# EAGLE board LEDpanelmpsl (EAGLE 6.6.0)
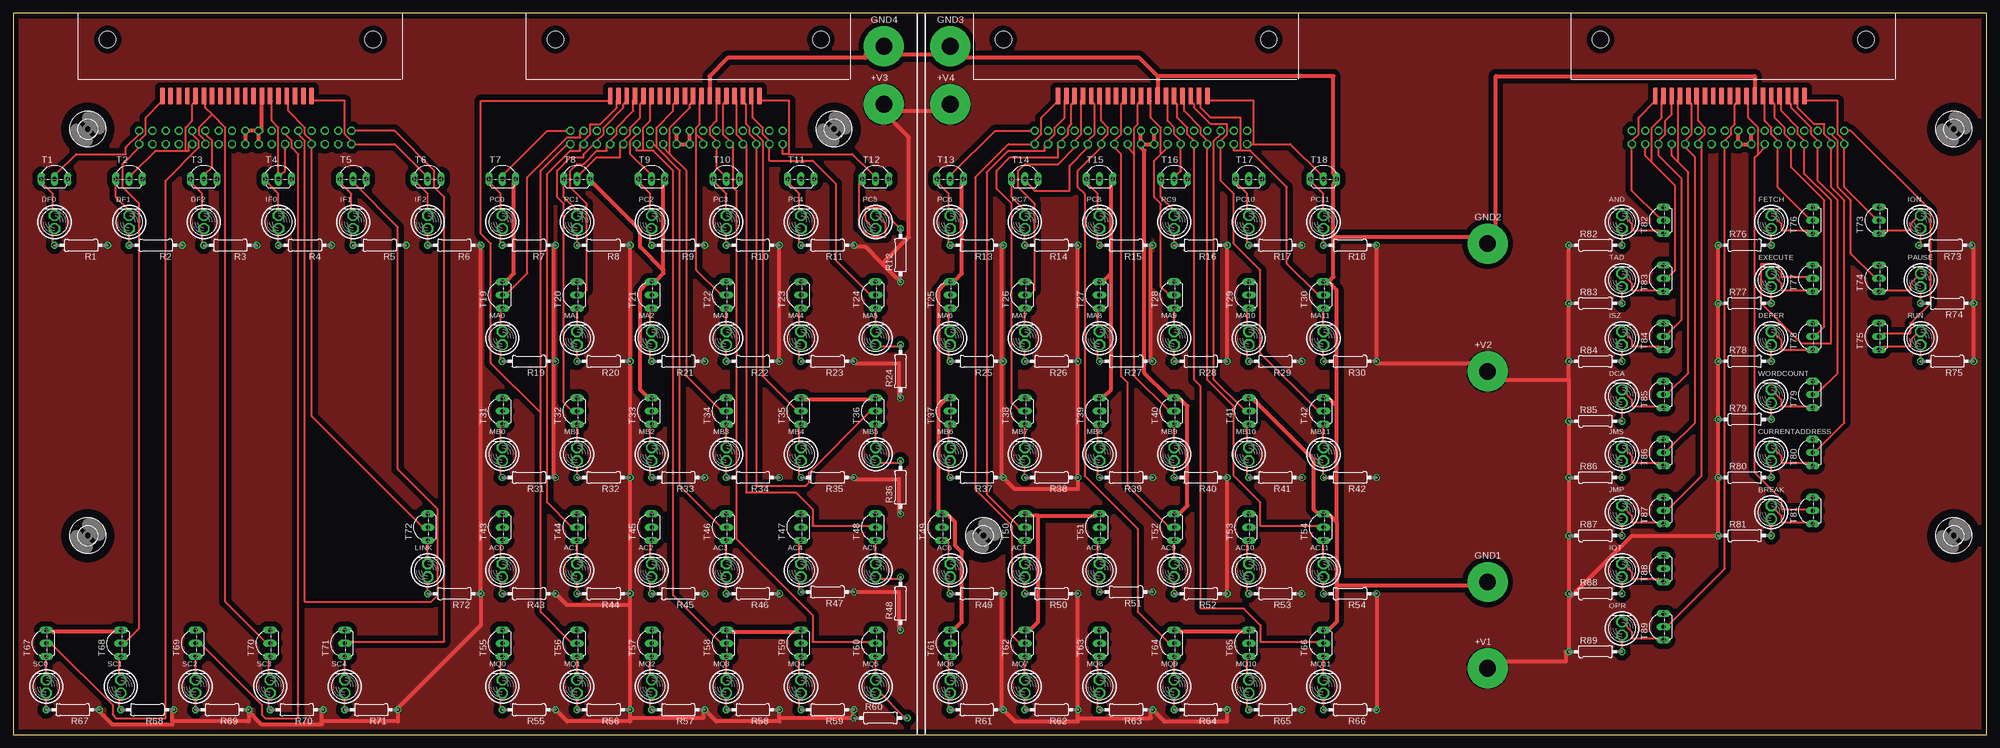
[diagram p2: board, top side]
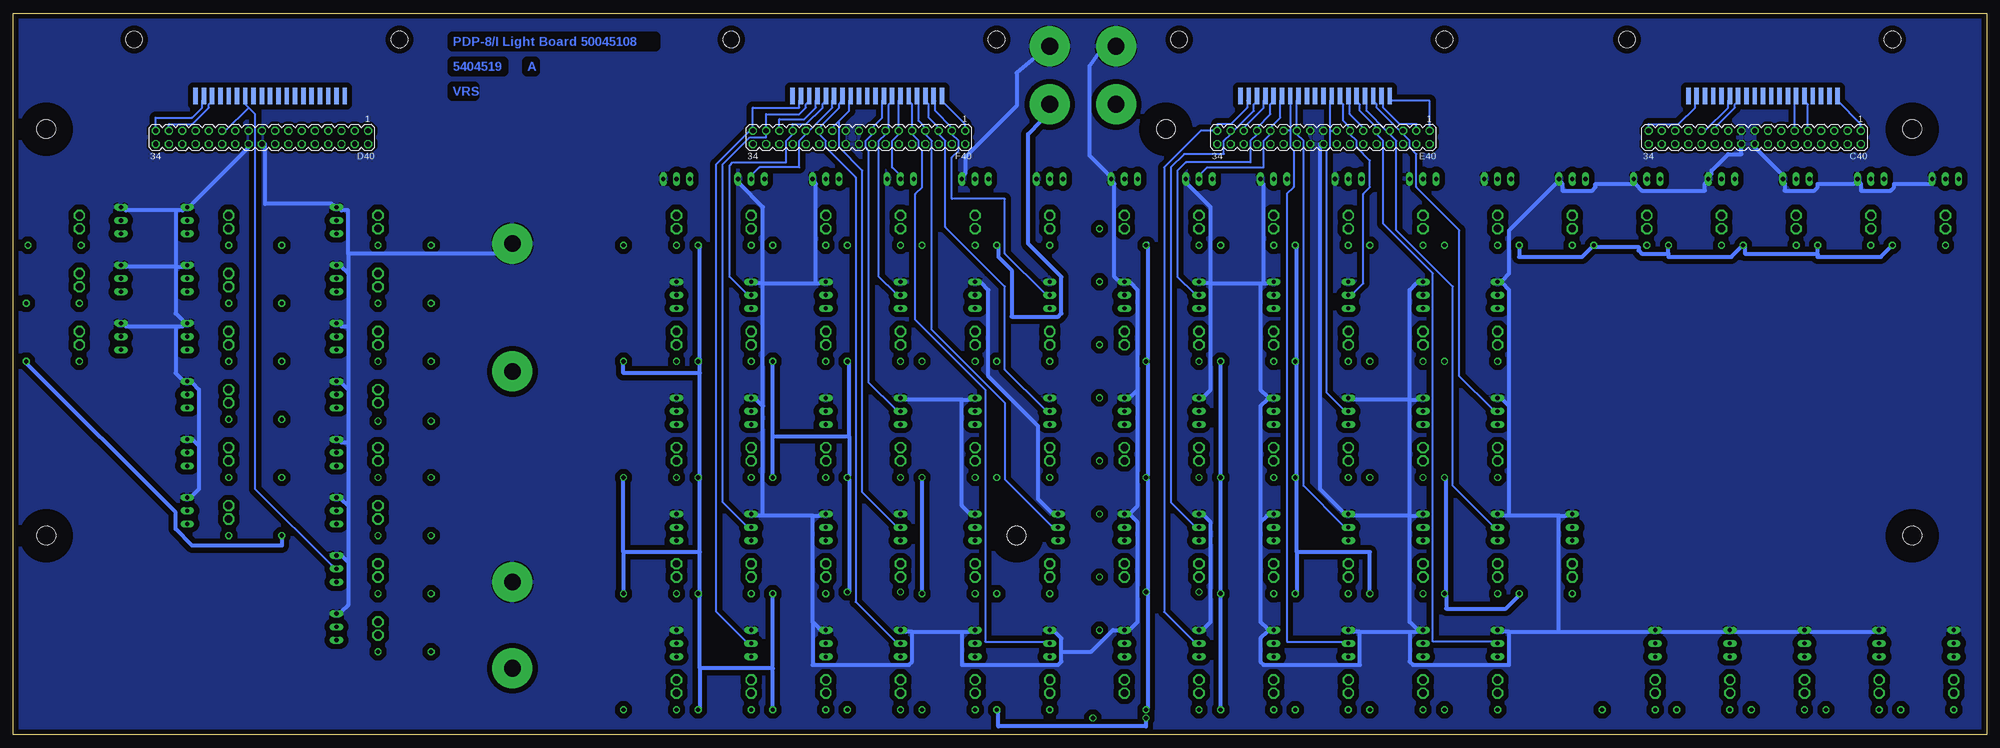
[diagram p3: board, bottom side, seen from below]

Size 377.82 x 138.11 mm. Coordinates in mm from the lower left corner, seen from the top.
Outline: 377.82,0 377.82,138.11 0,138.11 0,0 377.82,0
Copper layers (1*16): Top 0.035mm / dielectric 1.5mm / Bottom 0.035mm
Design rules "15mils": minimum track width 15mil, minimum drill 24mil, track to track 15mil, track to pad 10mil, pad to pad 10mil, via to via 10mil, smd to smd 10mil, copper to edge 25mil, drill to drill 10mil, minimum pad ring 10mil, minimum via ring 8mil, stop-mask expansion 0mil, vias tented up to drill 0mil, thermal gap 10mil
Net classes: 1 supply: width 0.762 mm

## Footprints (pad centres in the part's own frame; a part is rotated, then mirrored left to right if it is on the bottom)
SPADELUG = drill 3.175 pad 7.62: 1 0,0
BULB = drill 1.422 octagon: A 0,0; B 0,2.54
MA17-2 = drill 1.016 octagon: 1 -20.32,-1.27; 2 -20.32,1.27; 3 -17.78,-1.27; 4 -17.78,1.27; 5 -15.24,-1.27; 6 -15.24,1.27; 7 -12.7,-1.27; 8 -12.7,1.27; 9 -10.16,-1.27; 10 -10.16,1.27; 11 -7.62,-1.27; 12 -7.62,1.27; 13 -5.08,-1.27; 14 -5.08,1.27; 15 -2.54,-1.27; 16 -2.54,1.27; 17 0,-1.27; 18 0,1.27; 19 2.54,-1.27; 20 2.54,1.27; 21 5.08,-1.27; 22 5.08,1.27; 23 7.62,-1.27; 24 7.62,1.27; 25 10.16,-1.27; 26 10.16,1.27; 27 12.7,-1.27; 28 12.7,1.27; 29 15.24,-1.27; 30 15.24,1.27; 31 17.78,-1.27; 32 17.78,1.27; 33 20.32,-1.27; 34 20.32,1.27
FLEX19 = smd 3.175 x 0.838: 1 0,14.287; 2 0,12.7; 3 0,11.113; 4 0,9.525; 5 0,7.938; 6 0,6.35; 7 0,4.763; 8 0,3.175; 9 0,1.587; 10 0,0; 11 0,-1.587; 12 0,-3.175; 13 0,-4.763; 14 0,-6.35; 15 0,-7.938; 16 0,-9.525; 17 0,-11.113; 18 0,-12.7; 19 0,-14.287
0207/10 = drill 0.813 octagon: 1 -5.08,0; 2 5.08,0
TO92-CBE = drill 0.813 long: B 0,0; C -2.54,0; E 2.54,0
STRAIN-RELIEF = hole 3.175: 7.62,56.515; 7.62,5.715
3,6 = hole 3.6: 0,0

## Placement (x,y rotation side)
+V1  LUG  [SPADELUG]  282.26,12.7 0 top
+V2  LUG  [SPADELUG]  282.26,69.53 0 top
+V3  LUG  [SPADELUG]  166.69,120.65 0 top
+V4  LUG  [SPADELUG]  179.39,120.65 0 top
AC0  [BULB]  93.66,30.16 0 top
AC1  [BULB]  107.95,30.16 0 top
AC2  [BULB]  122.24,30.16 0 top
AC3  [BULB]  136.53,30.16 0 top
AC4  [BULB]  150.81,30.16 0 top
AC5  [BULB]  165.1,30.16 0 top
AC6  [BULB]  179.39,30.16 0 top
AC7  [BULB]  193.68,30.16 0 top
AC8  [BULB]  207.96,30.16 0 top
AC9  [BULB]  222.25,30.16 0 top
AC10  [BULB]  236.54,30.16 0 top
AC11  [BULB]  250.82,30.16 0 top
AND  [BULB]  307.98,96.84 0 top
BREAK  [BULB]  336.55,41.27 0 top
C40  [MA17-2]  44.45,114.3 180 bottom
C40BOT  FLEX19  [FLEX19]  42.86,122.24 90 top
C40TOP  FLEX19  [FLEX19]  42.86,122.24 270 bottom
CURRENTADDRESS  [BULB]  336.55,52.39 0 top
D40  [MA17-2]  330.2,114.3 180 bottom
D40BOT  FLEX19  [FLEX19]  128.59,122.24 90 top
D40TOP  FLEX19  [FLEX19]  128.59,122.24 270 bottom
DCA  [BULB]  307.98,63.5 0 top
DEFER  [BULB]  336.55,74.61 0 top
DF0  [BULB]  7.94,96.84 0 top
DF1  [BULB]  22.23,96.84 0 top
DF2  [BULB]  36.51,96.84 0 top
E40  [MA17-2]  127,114.3 180 bottom
E40BOT  FLEX19  [FLEX19]  214.31,122.24 90 top
E40TOP  FLEX19  [FLEX19]  214.31,122.24 270 bottom
EXECUTE  [BULB]  336.55,85.72 0 top
F40  [MA17-2]  215.9,114.3 180 bottom
F40BOT  FLEX19  [FLEX19]  328.61,122.24 90 top
F40TOP  FLEX19  [FLEX19]  328.61,122.24 270 bottom
FETCH  [BULB]  336.55,96.84 0 top
GND1  LUG  [SPADELUG]  282.26,29.21 0 top
GND2  LUG  [SPADELUG]  282.26,93.98 0 top
GND3  LUG  [SPADELUG]  179.39,131.76 0 top
GND4  LUG  [SPADELUG]  166.69,131.76 0 top
IF0  [BULB]  50.8,96.84 0 top
IF1  [BULB]  65.09,96.84 0 top
IF2  [BULB]  79.38,96.84 0 top
ION  [BULB]  365.12,96.84 0 top
IOT  [BULB]  307.98,30.16 0 top
ISZ  [BULB]  307.98,74.61 0 top
JMP  [BULB]  307.98,41.27 0 top
JMS  [BULB]  307.98,52.39 0 top
LINK  [BULB]  79.38,30.16 0 top
MA0  [BULB]  93.66,74.61 0 top
MA1  [BULB]  107.95,74.61 0 top
MA2  [BULB]  122.24,74.61 0 top
MA3  [BULB]  136.53,74.61 0 top
MA4  [BULB]  150.81,74.61 0 top
MA5  [BULB]  165.1,74.61 0 top
MA6  [BULB]  179.39,74.61 0 top
MA7  [BULB]  193.68,74.61 0 top
MA8  [BULB]  207.96,74.61 0 top
MA9  [BULB]  222.25,74.61 0 top
MA10  [BULB]  236.54,74.61 0 top
MA11  [BULB]  250.82,74.61 0 top
MB0  [BULB]  93.66,52.39 0 top
MB1  [BULB]  107.95,52.39 0 top
MB2  [BULB]  122.24,52.39 0 top
MB3  [BULB]  136.53,52.39 0 top
MB4  [BULB]  150.81,52.39 0 top
MB5  [BULB]  165.1,52.39 0 top
MB6  [BULB]  179.39,52.39 0 top
MB7  [BULB]  193.68,52.39 0 top
MB8  [BULB]  207.96,52.39 0 top
MB9  [BULB]  222.25,52.39 0 top
MB10  [BULB]  236.54,52.39 0 top
MB11  [BULB]  250.82,52.39 0 top
MQ0  [BULB]  93.66,7.94 0 top
MQ1  [BULB]  107.95,7.94 0 top
MQ2  [BULB]  122.24,7.94 0 top
MQ3  [BULB]  136.53,7.94 0 top
MQ4  [BULB]  150.81,7.94 0 top
MQ5  [BULB]  165.1,7.94 0 top
MQ6  [BULB]  179.39,7.94 0 top
MQ7  [BULB]  193.68,7.94 0 top
MQ8  [BULB]  207.96,7.94 0 top
MQ9  [BULB]  222.25,7.94 0 top
MQ10  [BULB]  236.54,7.94 0 top
MQ11  [BULB]  250.82,7.94 0 top
OPR  [BULB]  307.98,19.05 0 top
PAUSE  [BULB]  365.12,85.72 0 top
PC0  [BULB]  93.66,96.84 0 top
PC1  [BULB]  107.95,96.84 0 top
PC2  [BULB]  122.24,96.84 0 top
PC3  [BULB]  136.53,96.84 0 top
PC4  [BULB]  150.81,96.84 0 top
PC5  [BULB]  165.1,96.84 0 top
PC6  [BULB]  179.39,96.84 0 top
PC7  [BULB]  193.68,96.84 0 top
PC8  [BULB]  207.96,96.84 0 top
PC9  [BULB]  222.25,96.84 0 top
PC10  [BULB]  236.54,96.84 0 top
PC11  [BULB]  250.82,96.84 0 top
R1  1.5K  [0207/10]  13.02,93.66 180 top
R2  1.5K  [0207/10]  27.3,93.66 180 top
R3  1.5K  [0207/10]  41.59,93.66 180 top
R4  1.5K  [0207/10]  55.88,93.66 180 top
R5  1.5K  [0207/10]  70.17,93.66 180 top
R6  1.5K  [0207/10]  84.45,93.66 180 top
R7  1.5K  [0207/10]  98.74,93.66 180 top
R8  1.5K  [0207/10]  113.03,93.66 180 top
R9  1.5K  [0207/10]  127.32,93.66 180 top
R10  1.5K  [0207/10]  141.6,93.66 180 top
R11  1.5K  [0207/10]  155.89,93.66 180 top
R12  1.5K  [0207/10]  169.86,91.76 90 top
R13  1.5K  [0207/10]  184.47,93.66 180 top
R14  1.5K  [0207/10]  198.75,93.66 180 top
R15  1.5K  [0207/10]  213.04,93.66 180 top
R16  1.5K  [0207/10]  227.33,93.66 180 top
R17  1.5K  [0207/10]  241.62,93.66 180 top
R18  1.5K  [0207/10]  255.91,93.66 180 top
R19  1.5K  [0207/10]  98.74,71.44 180 top
R20  1.5K  [0207/10]  113.03,71.44 180 top
R21  1.5K  [0207/10]  127.32,71.44 180 top
R22  1.5K  [0207/10]  141.6,71.44 180 top
R23  1.5K  [0207/10]  155.89,71.44 180 top
R24  1.5K  [0207/10]  169.86,69.53 90 top
R25  1.5K  [0207/10]  184.47,71.44 180 top
R26  1.5K  [0207/10]  198.75,71.44 180 top
R27  1.5K  [0207/10]  213.04,71.44 180 top
R28  1.5K  [0207/10]  227.33,71.44 180 top
R29  1.5K  [0207/10]  241.62,71.44 180 top
R30  1.5K  [0207/10]  255.91,71.44 180 top
R31  1.5K  [0207/10]  98.74,49.21 180 top
R32  1.5K  [0207/10]  113.03,49.21 180 top
R33  1.5K  [0207/10]  127.32,49.21 180 top
R34  1.5K  [0207/10]  141.6,49.21 180 top
R35  1.5K  [0207/10]  155.89,49.21 180 top
R36  1.5K  [0207/10]  169.86,47.31 90 top
R37  1.5K  [0207/10]  184.47,49.21 180 top
R38  1.5K  [0207/10]  198.75,49.21 180 top
R39  1.5K  [0207/10]  213.04,49.21 180 top
R40  1.5K  [0207/10]  227.33,49.21 180 top
R41  1.5K  [0207/10]  241.62,49.21 180 top
R42  1.5K  [0207/10]  255.91,49.21 180 top
R43  1.5K  [0207/10]  98.74,26.99 180 top
R44  1.5K  [0207/10]  113.03,26.99 180 top
R45  1.5K  [0207/10]  127.32,26.99 180 top
R46  1.5K  [0207/10]  141.6,26.99 180 top
R47  1.5K  [0207/10]  155.89,27.3 180 top
R48  1.5K  [0207/10]  169.86,25.08 90 top
R49  1.5K  [0207/10]  184.47,26.99 180 top
R50  1.5K  [0207/10]  198.75,26.99 180 top
R51  1.5K  [0207/10]  213.04,27.3 180 top
R52  1.5K  [0207/10]  227.33,26.99 180 top
R53  1.5K  [0207/10]  241.62,26.99 180 top
R54  1.5K  [0207/10]  255.91,26.99 180 top
R55  1.5K  [0207/10]  98.74,4.76 180 top
R56  1.5K  [0207/10]  113.03,4.76 180 top
R57  1.5K  [0207/10]  127.32,4.76 180 top
R58  1.5K  [0207/10]  141.6,4.76 180 top
R59  1.5K  [0207/10]  155.89,4.76 180 top
R60  1.5K  [0207/10]  166.05,3.17 0 top
R61  1.5K  [0207/10]  184.47,4.76 180 top
R62  1.5K  [0207/10]  198.75,4.76 180 top
R63  1.5K  [0207/10]  213.04,4.76 180 top
R64  1.5K  [0207/10]  227.33,4.76 180 top
R65  1.5K  [0207/10]  241.62,4.76 180 top
R66  1.5K  [0207/10]  255.91,4.76 180 top
R67  1.5K  [0207/10]  11.43,4.76 180 top
R68  1.5K  [0207/10]  25.72,4.76 180 top
R69  1.5K  [0207/10]  40.01,4.76 180 top
R70  1.5K  [0207/10]  54.29,4.76 180 top
R71  1.5K  [0207/10]  68.58,4.76 180 top
R72  1.5K  [0207/10]  84.45,26.99 180 top
R73  1.5K  [0207/10]  369.89,93.66 180 top
R74  1.5K  [0207/10]  370.2,82.55 180 top
R75  1.5K  [0207/10]  370.2,71.44 180 top
R76  1.5K  [0207/10]  331.47,93.66 0 top
R77  1.5K  [0207/10]  331.47,82.55 0 top
R78  1.5K  [0207/10]  331.47,71.44 0 top
R79  1.5K  [0207/10]  331.47,60.33 0 top
R80  1.5K  [0207/10]  331.47,49.21 0 top
R81  1.5K  [0207/10]  331.47,38.1 0 top
R82  1.5K  [0207/10]  302.89,93.66 0 top
R83  1.5K  [0207/10]  302.89,82.55 0 top
R84  1.5K  [0207/10]  302.89,71.44 0 top
R85  1.5K  [0207/10]  302.89,60.01 0 top
R86  1.5K  [0207/10]  302.89,49.21 0 top
R87  1.5K  [0207/10]  302.89,38.1 0 top
R88  1.5K  [0207/10]  302.89,26.99 0 top
R89  1.5K  [0207/10]  302.89,15.88 0 top
RUN  [BULB]  365.12,74.61 0 top
SC0  [BULB]  6.35,7.94 0 top
SC1  [BULB]  20.64,7.94 0 top
SC2  [BULB]  34.92,7.94 0 top
SC3  [BULB]  49.21,7.94 0 top
SC4  [BULB]  63.5,7.94 0 top
T1  [TO92-CBE]  7.94,106.36 0 top
T2  [TO92-CBE]  22.23,106.36 0 top
T3  [TO92-CBE]  36.51,106.36 0 top
T4  [TO92-CBE]  50.8,106.36 0 top
T5  [TO92-CBE]  65.09,106.36 0 top
T6  [TO92-CBE]  79.38,106.36 0 top
T7  [TO92-CBE]  93.66,106.36 0 top
T8  [TO92-CBE]  107.95,106.36 0 top
T9  [TO92-CBE]  122.24,106.36 0 top
T10  [TO92-CBE]  136.53,106.36 0 top
T11  [TO92-CBE]  150.81,106.36 0 top
T12  [TO92-CBE]  165.1,106.36 0 top
T13  [TO92-CBE]  179.39,106.36 0 top
T14  [TO92-CBE]  193.68,106.36 0 top
T15  [TO92-CBE]  207.96,106.36 0 top
T16  [TO92-CBE]  222.25,106.36 0 top
T17  [TO92-CBE]  236.54,106.36 0 top
T18  [TO92-CBE]  250.82,106.36 0 top
T19  [TO92-CBE]  93.66,84.14 90 top
T20  [TO92-CBE]  107.95,84.14 90 top
T21  [TO92-CBE]  122.24,84.14 90 top
T22  [TO92-CBE]  136.53,84.14 90 top
T23  [TO92-CBE]  150.81,84.14 90 top
T24  [TO92-CBE]  165.1,84.14 90 top
T25  [TO92-CBE]  179.39,84.14 90 top
T26  [TO92-CBE]  193.68,84.14 90 top
T27  [TO92-CBE]  207.96,84.14 90 top
T28  [TO92-CBE]  222.25,84.14 90 top
T29  [TO92-CBE]  236.54,84.14 90 top
T30  [TO92-CBE]  250.82,84.14 90 top
T31  [TO92-CBE]  93.66,61.91 90 top
T32  [TO92-CBE]  107.95,61.91 90 top
T33  [TO92-CBE]  122.24,61.91 90 top
T34  [TO92-CBE]  136.53,61.91 90 top
T35  [TO92-CBE]  150.81,61.91 90 top
T36  [TO92-CBE]  165.1,61.91 90 top
T37  [TO92-CBE]  179.39,61.91 90 top
T38  [TO92-CBE]  193.68,61.91 90 top
T39  [TO92-CBE]  207.96,61.91 90 top
T40  [TO92-CBE]  222.25,61.91 90 top
T41  [TO92-CBE]  236.54,61.91 90 top
T42  [TO92-CBE]  250.82,61.91 90 top
T43  [TO92-CBE]  93.66,39.69 90 top
T44  [TO92-CBE]  107.95,39.69 90 top
T45  [TO92-CBE]  122.24,39.69 90 top
T46  [TO92-CBE]  136.53,39.69 90 top
T47  [TO92-CBE]  150.81,39.69 90 top
T48  [TO92-CBE]  165.1,39.69 90 top
T49  [TO92-CBE]  177.8,39.69 90 top
T50  [TO92-CBE]  193.68,39.69 90 top
T51  [TO92-CBE]  207.96,39.69 90 top
T52  [TO92-CBE]  222.25,39.69 90 top
T53  [TO92-CBE]  236.54,39.69 90 top
T54  [TO92-CBE]  250.82,39.69 90 top
T55  [TO92-CBE]  93.66,17.46 90 top
T56  [TO92-CBE]  107.95,17.46 90 top
T57  [TO92-CBE]  122.24,17.46 90 top
T58  [TO92-CBE]  136.53,17.46 90 top
T59  [TO92-CBE]  150.81,17.46 90 top
T60  [TO92-CBE]  165.1,17.46 90 top
T61  [TO92-CBE]  179.39,17.46 90 top
T62  [TO92-CBE]  193.68,17.46 90 top
T63  [TO92-CBE]  207.96,17.46 90 top
T64  [TO92-CBE]  222.25,17.46 90 top
T65  [TO92-CBE]  236.54,17.46 90 top
T66  [TO92-CBE]  250.82,17.46 90 top
T67  [TO92-CBE]  6.35,17.46 90 top
T68  [TO92-CBE]  20.64,17.46 90 top
T69  [TO92-CBE]  34.92,17.46 90 top
T70  [TO92-CBE]  49.21,17.46 90 top
T71  [TO92-CBE]  63.5,17.46 90 top
T72  [TO92-CBE]  79.38,39.69 90 top
T73  [TO92-CBE]  357.19,98.42 90 top
T74  [TO92-CBE]  357.19,87.31 90 top
T75  [TO92-CBE]  357.19,76.2 90 top
T76  [TO92-CBE]  344.49,98.42 90 top
T77  [TO92-CBE]  344.49,87.31 90 top
T78  [TO92-CBE]  344.49,76.2 90 top
T79  [TO92-CBE]  344.49,65.09 90 top
T80  [TO92-CBE]  344.49,53.98 90 top
T81  [TO92-CBE]  344.49,42.86 90 top
T82  [TO92-CBE]  315.91,98.42 90 top
T83  [TO92-CBE]  315.91,87.31 90 top
T84  [TO92-CBE]  315.91,76.2 90 top
T85  [TO92-CBE]  315.91,65.09 90 top
T86  [TO92-CBE]  315.91,53.98 90 top
T87  [TO92-CBE]  315.91,42.86 90 top
T88  [TO92-CBE]  315.91,31.75 90 top
T89  [TO92-CBE]  315.91,20.64 90 top
TAD  [BULB]  307.98,85.72 0 top
U$1  [STRAIN-RELIEF]  74.61,125.41 90 top
U$2  [STRAIN-RELIEF]  160.34,125.41 90 top
U$3  [STRAIN-RELIEF]  246.06,125.41 90 top
U$4  [STRAIN-RELIEF]  360.36,125.41 90 top
U$5  [3,6]  371.48,115.89 0 top
U$6  [3,6]  371.48,38.1 0 top
U$7  [3,6]  185.74,38.1 0 top
U$8  [3,6]  14.29,38.1 0 top
U$9  [3,6]  14.29,115.89 0 top
U$11  [3,6]  157.16,115.89 0 top
WORDCOUNT  [BULB]  336.55,63.5 0 top

## Tracks (layer width: path | path; a pad name or v marks a point on that pad's centre or on a via)
+15V
  Top 0.762: 30.48,2.54 30.48,4.45 R68.1 | 30.48,2.54 30.48,1.91 19.05,1.91 16.51,4.45 R67.1 | 45.09,4.45 47.62,1.91 59.05,1.91 59.05,2.54 | 59.05,2.54 59.05,4.45 R70.1 | 45.09,4.45 R69.1 45.09,4.45 | 30.48,2.54 45.09,2.54 45.09,4.45 | R31.1 103.5,49.53 103.5,71.12 R19.1 103.5,71.75 103.5,93.34 R7.1 | 59.05,2.54 73.66,2.54 73.66,4.45 R71.1 73.66,5.08 89.53,20.95 89.53,26.67 R72.1 89.53,27.3 89.53,93.34 R6.1 | 166.37,90.17 169.54,87 R12.1 | 166.37,90.17 163.19,93.34 161.29,93.34 R11.1 | R23.1 161.29,71.12 169.54,71.12 169.54,64.77 R24.1 | R35.1 161.29,48.9 169.54,48.9 169.54,42.55 R36.1 | R47.1 161.29,27.3 169.54,27.3 169.54,20.32 R48.1 | 118.11,3.17 118.11,4.45 R56.1 118.11,5.08 118.11,24.77 | 118.11,3.17 118.11,2.54 106.05,2.54 104.14,4.45 R55.1 | 118.11,24.77 118.11,26.67 R44.1 118.11,27.3 118.11,48.9 R32.1 118.11,49.53 118.11,71.12 R20.1 118.11,71.75 118.11,93.34 R8.1 | 160.66,3.17 160.66,4.45 R59.1 | 160.66,3.17 R60.1 160.66,3.17 | 146.69,3.17 146.69,4.45 R58.1 | 146.69,3.17 146.69,2.54 134.62,2.54 132.72,4.45 R57.1 132.08,4.45 132.08,3.17 118.11,3.17 | R10.1 146.69,93.34 146.69,71.75 R22.1 | 160.66,3.17 146.69,3.17 | 118.11,24.77 106.05,24.77 104.14,26.67 R43.1 | R13.1 189.23,93.34 189.23,71.75 R25.1 189.23,71.12 189.23,49.53 R37.1 189.87,48.9 191.77,46.99 203.84,46.99 203.84,48.9 R38.1 203.84,49.53 203.84,71.12 R26.1 203.84,71.75 203.84,93.34 R14.1 | R49.1 189.23,26.67 189.23,5.08 R61.1 189.87,4.45 191.77,2.54 203.84,2.54 203.84,3.17 | R50.1 203.84,26.67 203.84,5.08 R62.1 203.84,4.45 203.84,3.17 | R66.1 260.99,5.08 260.99,26.67 R54.1 | R15.1 217.81,93.34 217.81,71.75 R27.1
  Top 0.762: R64.1 232.41,4.45 232.41,2.54 220.34,2.54 218.44,4.45 R63.1 217.81,4.45 217.81,3.17 203.84,3.17 | R40.1 232.41,48.9 232.41,27.3 R52.1 | R16.1 232.41,93.34 232.41,71.75 R28.1 | R75.1 375.29,71.75 375.29,81.92 R74.1 375.29,83.19 375.29,93.34 R73.1 | R76.1 326.39,93.34 326.39,83.19 R77.1 326.39,81.92 326.39,71.75 R78.1 326.39,71.12 326.39,60.96 R79.1 326.39,59.69 326.39,49.53 R80.1 326.39,48.9 326.39,38.73 R81.1 325.75,38.1 309.88,38.1 297.81,26.04 | R18.1 260.99,93.34 260.99,71.75 R30.1 260.99,71.12 278.76,71.12 +V2.1 285.75,67.94 297.81,67.94 | R82.1 297.81,93.34 297.81,83.19 R83.1 297.81,81.92 297.81,71.75 R84.1 297.81,71.12 297.81,67.94 | 297.81,26.04 297.81,26.67 R88.1 297.81,27.3 297.81,37.47 R87.1 297.81,38.73 297.81,48.9 R86.1 297.81,49.53 297.81,59.69 R85.1 297.81,60.33 297.81,67.94 | 297.81,26.04 297.81,16.51 R89.1 297.18,15.88 297.18,13.97 285.75,13.97 +V1.1 | +V4.1 175.9,119.38 | 166.37,90.17 171.45,95.25 171.45,114.3 168.28,117.47 +V3.1 170.18,119.38 175.58,119.38
  Bottom 0.762: R6.1 89.53,93.34 89.53,91.44 77.47,91.44 75.56,93.34 R5.1 74.93,93.34 66.67,93.34 66.67,92.71 66.04,92.08 60.96,92.08 | 32.38,92.08 32.38,93.34 R2.1 | 32.38,92.08 32.38,91.44 20.32,91.44 18.41,93.34 R1.1 | 60.96,92.08 60.96,93.34 R4.1 | 60.96,92.08 60.96,91.44 48.9,91.44 46.99,93.34 R3.1 46.35,93.34 46.35,92.08 32.38,92.08 | R31.1 103.5,48.9 103.5,27.3 R43.1 103.5,26.67 103.5,24.13 92.08,24.13 89.53,26.67 R72.1 | 160.66,27.3 160.66,48.9 R35.1 160.66,49.53 160.66,71.12 R23.1 160.66,71.75 160.66,93.34 R11.1 160.66,93.98 | 160.66,27.3 R47.1 160.66,27.3 | 132.08,34.92 132.08,48.9 R33.1 132.08,49.53 132.08,71.12 R21.1 132.08,71.75 132.08,93.34 R9.1 | 132.08,34.92 132.08,27.3 R45.1 | 132.08,34.92 118.11,34.92 118.11,27.3 R44.1 | R58.1 146.69,5.08 146.69,26.67 R46.1 146.69,27.3 146.69,48.9 R34.1 146.69,49.53 146.69,71.12 R22.1 | 160.66,27.3 160.66,5.08 R59.1 | +V4.1 180.97,117.47 183.51,114.94 183.51,93.98 177.16,87.63 177.16,80.64 177.8,80.01 186.69,80.01 186.69,88.9 189.23,91.44 189.23,93.34 R13.1 | R38.1 203.84,48.9 203.84,27.3 R50.1 | 260.99,34.92 260.99,27.3 R54.1 | 260.99,34.92 260.99,48.9 R42.1 | 246.38,12.7 246.38,26.67 R53.1 246.38,27.3 246.38,34.92 | 246.38,12.7 246.38,5.08 R65.1 | 246.38,34.92 246.38,48.9 R41.1 246.38,49.53 246.38,69.22 | 246.38,69.22 246.38,71.12 R29.1 246.38,71.75 246.38,93.34 R17.1 | 246.38,34.92 260.99,34.92 | R51.1 217.81,27.3 217.81,48.9 R39.1 217.81,49.53 217.81,57.15 | 217.81,57.15 217.81,71.12 R27.1 | 232.41,12.7 232.41,5.08 R64.1 | 232.41,12.7 232.41,26.67 R52.1 | 232.41,57.15 232.41,49.53 R40.1 | 232.41,57.15 232.41,71.12 R28.1
  Bottom 0.762: 232.41,57.15 217.81,57.15 | 232.41,12.7 246.38,12.7 | R75.1 375.29,71.12 346.71,42.55 346.71,39.37 343.54,36.2 326.39,36.2 326.39,37.47 R81.1 | 246.38,69.22 260.99,69.22 260.99,71.12 R30.1 | R60.1 160.97,1.59 189.23,1.59 189.23,4.45 | 189.23,4.45 189.23,4.76 | 189.23,4.45 R61.1
  pour Top (isolate 1.016): 0,0 377.82,0 377.82,138.11 0,138.11
AC0
  Bottom 0.381: T43.B 94.61,40.01 102.23,47.62 102.23,85.72 113.03,96.52 113.03,113.67 114.3,114.94 E40.7 114.94,115.57 118.75,119.38 118.75,121.28 D40TOP.4
AC1
  Top 0.381: T44.B 106.68,40.01 102.23,44.45 102.23,107.31 106.68,111.76 108.58,111.76 108.58,113.03 E40.4 109.22,113.67 110.49,114.94 110.49,116.84 112.39,116.84 115.57,120.02 115.57,121.28 D40BOT.2
AC2
  Bottom 0.381: D40TOP.12 132.08,121.28 E40.21 132.08,114.94 130.81,113.67 130.81,47.62 123.19,40.01 T45.B
AC3
  Top 0.381: 123.19,112.39 122.56,113.03 E40.14 | 123.19,112.39 127.64,107.95 127.64,47.62 135.25,40.01 T46.B | 123.19,112.39 123.19,116.2 126.36,119.38 126.36,120.65 127,121.28 D40BOT.9
AC4
  Bottom 0.381: D40TOP.17 139.7,121.28 140.34,120.65 140.34,119.38 144.15,115.57 E40.31 144.78,114.94 146.05,113.67 146.05,111.12 153.67,111.12 156.21,108.58 156.21,44.45 151.76,40.01 T47.B
AC5
  Top 0.381: T48.B 163.83,40.01 153.03,40.01 153.03,43.18 149.86,46.35 140.34,46.35 140.34,113.03 E40.28 139.7,113.67 138.43,114.94 138.43,121.28 D40BOT.16
AC6
  Bottom 0.381: E40TOP.4 204.47,121.28 204.47,117.47 203.2,116.2 F40.7 203.2,114.94 201.93,113.67 201.93,77.47 187.96,63.5 187.96,48.9 179.07,40.01 T49.B
AC7
  Top 0.381: T50.B 192.41,40.01 186.37,46.04 186.37,107.63 190.5,111.76 197.49,111.76 197.49,113.03 F40.4 198.12,113.67 199.39,114.94 199.39,116.2 201.29,118.11 201.29,121.28 E40BOT.2
AC8
  Bottom 0.381: 219.71,117.47 220.98,116.2 F40.21 | 219.71,117.47 217.81,119.38 217.81,121.28 E40TOP.12 | 219.71,117.47 219.71,112.39 215.26,107.95 215.26,46.35 208.91,40.01 T51.B
AC9
  Top 0.381: T52.B 220.98,40.01 213.36,47.62 213.36,67.31 212.09,68.58 212.09,111.12 210.82,112.39 F40.14 210.82,113.67 212.09,114.94 212.09,120.65 212.72,121.28 E40BOT.9
AC10
  Bottom 0.381: T53.B 237.49,40.01 241.94,44.45 241.94,109.22 236.85,114.3 233.68,114.3 F40.31 233.68,118.75 227.33,118.75 226.06,120.02 226.06,120.65 225.43,121.28 E40TOP.17
AC11
  Top 0.381: T54.B 249.56,40.01 238.76,40.01 238.76,44.45 233.68,49.53 233.68,62.87 228.6,67.94 F40.28 228.6,113.67 227.33,114.94 227.33,116.2 224.16,119.38 224.16,121.28 E40BOT.16
AND
  Top 0.381: T82.B 314.96,99.06 309.88,104.14 D40.2 309.88,113.67 311.15,114.94 311.15,118.11 314.32,121.28 F40BOT.1
BREAK
  Top 0.381: 334.01,111.12 335.28,112.39 D40.22 | 334.01,111.12 333.38,110.49 333.38,50.16 338.45,45.09 338.45,43.18 343.54,43.18 T81.B | 334.01,111.12 334.01,116.2 332.11,118.11 332.11,121.28 F40BOT.12
CA
  Top 0.381: T80.B 345.44,54.61 350.52,59.69 350.52,102.23 347.98,104.78 D40.32 347.98,113.67 346.71,114.94 346.71,116.84 344.81,116.84 341.63,120.02 341.63,121.28 F40BOT.18
DCA
  Top 0.381: 318.77,109.54 317.5,110.81 D40.8 | 318.77,109.54 320.68,107.63 320.68,69.22 316.87,65.41 T85.B | 318.77,109.54 318.77,121.28 F40BOT.4
DEFER
  Top 0.381: T78.B 345.44,76.83 346.71,78.11 346.71,102.23 340.36,108.58 D40.26 340.36,113.67 339.09,114.94 339.09,116.2 337.19,118.11 337.19,120.65 336.55,121.28 F40BOT.15
DF0
  Top 0.381: T1.B 8.26,107.31 12.06,111.12 21.59,111.12 21.59,112.39 24.13,114.94 C40.1
  Bottom 0.381: C40TOP.1 28.57,121.28 24.13,116.84 24.13,116.2 C40.1
DF1
  Top 0.381: 33.02,111.76 33.66,111.76 33.66,113.03 C40.10 | 33.02,111.76 27.3,111.76 22.86,107.31 T2.B | 33.02,111.76 33.02,116.2 34.29,117.47 34.29,120.65 34.92,121.28 C40BOT.5
DF2
  Top 0.381: T3.B 36.83,107.31 38.1,108.58 38.1,113.67 36.83,114.94 C40.11
  Bottom 0.381: C40.11 36.83,121.28 C40TOP.6
EXECUTE
  Top 0.381: T77.B 343.54,87.63 338.45,87.63 338.45,88.9 337.19,90.17 334.64,90.17 334.64,82.55 342.26,74.93 347.98,74.93 347.98,102.23 342.9,107.31 D40.28 342.9,113.67 341.63,114.94 341.63,116.2 338.45,119.38 338.45,121.28 F40BOT.16
FETCH
  Top 0.381: T76.B 343.54,99.06 337.82,104.78 D40.24 337.82,113.67 336.55,114.94 336.55,116.2 335.28,117.47 335.28,121.28 F40BOT.14
GND
  Top 0.762: D40BOT.13 133.35,126.05 136.84,129.54 163.19,129.54 163.19,130.18 GND4.1 170.18,130.18 175.9,130.18 GND3.1 182.25,129.54 215.58,129.54 219.07,126.05 | T58.E 137.79,19.68 149.86,19.68 T59.E | T35.E 151.76,64.14 163.83,64.14 T36.E | 124.46,88.9 124.46,105.41 T9.E | 124.46,88.9 124.46,88.27 123.19,87 T21.E 121.28,86.36 120.02,85.09 120.02,66.04 121.28,64.77 T33.E | 124.46,88.9 120.02,93.34 120.02,96.52 111.12,105.41 T8.E | E40.17 E40.18 E40.20 E40.19 | T67.E 7.62,19.68 19.68,19.68 T68.E | C40.20 C40.19 | C40BOT.13 47.62,115.57 C40.19 | C40.18 C40.17 C40.19 | T19.E 94.61,87 95.89,88.27 95.89,105.41 T7.E | D40.17 D40.18 D40.20 D40.19 | T13.E 181.61,105.41 181.61,88.27 180.34,87 T25.E 178.44,86.36 177.16,85.09 177.16,62.87 | T61.E 180.34,20.32 181.61,21.59 181.61,34.92 180.34,36.2 180.34,40.64 179.07,41.91 T49.E 177.16,42.55 177.16,62.87 | 177.16,62.87 178.44,64.14 T37.E | 196.22,41.91 207.01,41.91 T51.E | 196.22,41.91 194.94,41.91 T50.E | 196.22,41.91 196.22,21.59 194.94,20.32 T62.E | 210.19,88.27 208.91,87 T27.E | 210.19,88.27 210.19,105.41 T15.E | 210.19,88.27 210.19,66.04 208.91,64.77 T39.E | T64.E 223.52,19.68 235.59,19.68 T65.E | F40.18 F40.20 F40.19 | F40.18 F40.17 | T52.E 223.52,42.55 224.79,43.81 224.79,62.87 223.52,64.14 T40.E 220.98,64.77 216.53,69.22 216.53,111.76 215.9,112.39 F40.18 | F40BOT.13 333.38,126.05 283.85,126.05 283.85,97.16 GND2.1 278.76,95.25 252.73,95.25 | 219.07,126.05 E40BOT.13 | 252.73,95.25 252.73,105.41 T18.E 252.73,107.31 252.73,126.05 219.07,126.05 | 252.73,95.25 252.73,87.63 252.09,87 T30.E 252.09,86.36 253.37,85.09 253.37,62.87 | 253.37,40.64 253.37,28.57
  Top 0.762: 253.37,28.57 253.37,21.59 252.09,20.32 T66.E | 253.37,40.64 252.09,41.91 T54.E 249.56,42.55 248.92,43.18 248.92,52.7 237.49,64.14 T41.E | 253.37,62.87 252.09,64.14 T42.E | 253.37,40.64 253.37,62.87 | 253.37,28.57 278.76,28.57 GND1.1
  Bottom 0.762: 139.06,40.64 137.79,41.91 T46.E | 139.06,40.64 139.06,21.59 137.79,20.32 T58.E 137.79,19.68 139.06,18.41 139.06,13.97 138.43,13.34 120.02,13.34 120.02,19.68 | 139.06,40.64 139.06,62.87 137.79,64.14 T34.E 137.79,64.77 139.06,66.04 139.06,86.36 | T47.E 149.86,41.91 148.59,40.64 148.59,21.59 149.86,20.32 T59.E | 148.59,86.36 149.86,86.36 T23.E | 148.59,86.36 139.06,86.36 | 139.06,86.36 138.43,86.36 | 138.43,86.36 137.79,86.36 T22.E | 138.43,86.36 138.43,105.41 T10.E | 148.59,86.36 148.59,100.97 153.03,105.41 T11.E | 148.59,86.36 148.59,66.04 149.86,64.77 T35.E | 162.56,66.04 162.56,85.09 163.83,86.36 T24.E 166.37,87 167,87.63 167,105.41 T12.E 168.28,107.31 171.77,110.81 171.77,127.95 170.18,130.18 GND4.1 | 162.56,66.04 163.83,64.77 T36.E | 162.56,66.04 162.56,43.81 163.83,42.55 T48.E 163.83,41.91 162.56,40.64 162.56,21.59 163.83,20.32 T60.E 167.32,20 171.45,15.88 177.16,15.88 | 110.49,64.14 121.28,64.14 T33.E | 110.49,64.14 109.22,64.14 T32.E | 110.49,64.14 110.49,85.09 109.22,86.36 T20.E | 120.02,19.68 121.28,19.68 T57.E | 120.02,19.68 110.49,19.68 | 110.49,19.68 109.22,19.68 T56.E 109.22,20.32 110.49,21.59 110.49,41.91 | 110.49,41.91 121.28,41.91 T45.E 123.19,42.55 127.64,46.99 127.64,113.03 E40.18 | 110.49,41.91 109.22,41.91 T44.E | 110.49,41.91 110.49,64.14 | T68.E 21.59,19.68 33.66,19.68 T69.E 36.2,19.68 48.26,19.68 T70.E 50.16,19.68 62.23,19.68 T71.E 64.77,19.68 81.92,19.68 | 91.44,19.68 81.92,19.68 | 91.44,19.68 92.71,19.68 T55.E | C40.20 46.99,111.12 49.53,111.12 52.7,107.95 52.7,107.31 T4.E 53.98,105.41 53.98,104.14 66.04,104.14 67.31,105.41 T5.E 67.94,105.41 74.93,105.41 74.93,104.78 75.56,104.14 81.28,104.14 81.28,105.41 T6.E 82.55,105.41 91.44,96.52 91.44,88.27 92.71,87 T19.E 92.71,86.36 91.44,85.09 91.44,62.87
  Bottom 0.762: T1.E 10.79,105.41 17.78,105.41 17.78,104.78 18.41,104.14 24.13,104.14 24.13,105.41 T2.E 25.4,105.41 32.38,105.41 32.38,104.78 33.02,104.14 38.73,104.14 38.73,105.41 T3.E 39.37,107.31 44.45,112.39 C40.18 | 91.44,41.91 92.71,41.91 T43.E | 81.92,41.91 91.44,41.91 | 81.92,41.91 80.64,41.91 T72.E | 91.44,62.87 92.71,64.14 T31.E | 91.44,41.91 91.44,62.87 | 81.92,19.68 81.92,41.91 | 110.49,19.68 110.49,13.97 109.86,13.34 91.44,13.34 91.44,19.68 | 313.69,33.02 313.69,24.77 314.96,23.5 T89.E | 313.69,33.02 314.96,34.29 T88.E | 313.69,43.81 314.96,45.09 T87.E | 313.69,43.81 313.69,33.02 | 313.69,55.88 314.96,55.88 T86.E | 313.69,55.88 313.69,43.81 | 313.69,66.04 314.96,67.31 T85.E | 313.69,66.04 313.69,55.88 | 313.69,78.11 314.96,78.11 T84.E | 313.69,78.11 313.69,66.04 | 313.69,88.27 314.96,89.53 T83.E | 313.69,88.27 313.69,78.11 | 313.69,92.08 313.69,88.27 | 313.69,92.08 313.69,100.33 314.96,100.33 T82.E 316.87,101.6 329.56,101.6 329.56,113.03 D40.18 | 346.71,100.33 356.24,100.33 T73.E | 346.71,100.33 345.44,100.33 T76.E 343.54,101.6 332.74,112.39 D40.20 | 342.26,55.24 342.26,46.99 343.54,45.72 T81.E | 342.26,55.24 343.54,56.52 T80.E | 342.26,55.24 342.26,66.04 343.54,67.31 T79.E 345.44,67.94 346.71,69.22 346.71,78.11 | 346.71,78.11 356.24,78.11 T75.E | 346.71,78.11 345.44,78.11 T78.E 345.44,79.38 346.71,80.64 346.71,89.53 | 346.71,89.53 356.24,89.53 T74.E | 346.71,89.53 345.44,89.53 T77.E | 346.71,100.33 346.71,89.53 | T26.E 192.41,86.36 191.13,85.09 191.13,68.58 181.61,59.05 181.61,45.09 179.07,42.55 T49.E | 205.74,19.68 207.01,19.68 T63.E | 205.74,19.68 196.22,19.68 | 196.22,19.68 194.94,19.68 T62.E
  Bottom 0.762: 196.22,64.14 207.01,64.14 T39.E | 196.22,64.14 194.94,64.14 T38.E | 196.22,64.14 196.22,43.81 194.94,42.55 T50.E | 177.16,15.88 177.16,13.97 177.8,13.34 196.22,13.34 196.22,19.68 | 177.16,15.88 177.16,18.41 178.44,19.68 T61.E | 234.31,86.36 235.59,86.36 T29.E | 234.31,86.36 224.16,86.36 | 224.16,86.36 223.52,86.36 T28.E | 224.16,86.36 224.16,105.41 T16.E | 234.31,86.36 234.31,100.97 238.76,105.41 T17.E | 234.31,41.91 235.59,41.91 T53.E | 224.79,41.91 234.31,41.91 | 224.79,41.91 223.52,41.91 T52.E | 234.31,62.87 235.59,64.14 T41.E | 234.31,41.91 234.31,62.87 | 224.79,21.59 223.52,20.32 T64.E | 224.79,21.59 224.79,41.91 | 234.31,62.87 234.31,86.36 | 205.74,19.68 205.74,13.97 206.38,13.34 224.79,13.34 224.79,21.59 | 313.69,92.08 285.12,92.08 GND2.1 | T14.E 195.58,107.31 195.58,110.49 185.74,120.33 185.74,126.68 182.25,129.54 GND3.1
  pour Bottom (isolate 1.016): 0,0 377.82,0 377.82,138.11 0,138.11
IF0
  Top 0.381: C40.24 52.07,107.95 51.44,107.31 T4.B 50.8,116.2 49.53,117.47 49.53,121.28 C40BOT.14
IF1
  Top 0.381: T5.B 65.41,105.41 73.66,97.16 73.66,50.8 81.28,43.18 81.28,26.67 80.01,25.4 55.88,25.4 55.88,113.67 54.61,114.94 C40.25
  Bottom 0.381: C40TOP.14 49.53,121.28 49.53,120.02 53.98,115.57 C40.25
IF2
  Top 0.381: T6.B 78.74,107.31 73.03,113.03 C40.34 64.77,113.67 63.5,114.94 63.5,121.28 57.15,121.28 C40BOT.19
ION
  Top 0.381: T73.B 356.24,99.06 350.52,104.78 D40.34 350.52,113.67 349.25,114.94 349.25,121.28 342.9,121.28 F40BOT.19
IOT
  Bottom 0.381: 332.74,120.02 333.38,120.65 F40TOP.13 | 332.74,120.02 331.47,118.75 331.47,46.99 316.87,32.38 T88.B | 332.74,120.02 337.19,115.57 D40.23
ISZ
  Top 0.381: F40BOT.3 317.5,118.75 316.23,117.47 316.23,114.94 314.96,113.67 D40.6 314.96,110.81 319.4,106.36 319.4,79.38 316.87,76.83 T84.B
JMP
  Top 0.381: F40BOT.6 322.58,121.28 322.58,117.47 323.85,116.2 323.85,114.94 322.58,113.67 D40.12 323.21,113.03 323.21,49.53 316.87,43.18 T87.B
JMS
  Top 0.381: F40BOT.5 320.68,121.28 321.31,120.65 321.31,114.94 320.04,113.67 D40.10 320.04,112.39 321.94,110.49 321.94,59.69 316.87,54.61 T86.B
LINK
  Top 0.381: T72.B 78.11,40.01 57.15,60.96 C40.28 57.15,113.67 55.88,114.94 55.88,116.2 52.7,119.38 52.7,121.28 C40BOT.16
MA0
  Top 0.381: T19.B 94.61,84.45 98.42,88.27 98.42,106.68 106.05,114.3 108.58,114.3 108.58,115.57 E40.3
  Bottom 0.381: D40TOP.2 115.57,121.28 115.57,120.02 112.39,116.84 109.22,116.84 E40.3
MA1
  Top 0.381: T20.B 109.22,84.45 109.86,85.09 109.86,101.6 106.68,104.78 106.68,107.95 107.95,109.22 109.22,109.22 111.76,111.76 113.67,111.76 113.67,113.03 E40.8 114.3,113.67 115.57,114.94 115.57,116.2 118.75,119.38 118.75,121.28 D40BOT.4
MA2
  Bottom 0.381: T21.B 121.28,84.45 119.38,86.36 119.38,103.5 118.11,104.78 118.11,109.86 120.65,112.39 120.65,113.67 121.92,114.94 E40.13 121.92,116.2 123.19,117.47 123.19,120.65 123.83,121.28 D40TOP.7
MA3
  Top 0.381: 130.81,114.94 130.81,116.2 131.44,116.84 131.44,121.28 D40BOT.12 | 130.81,114.94 132.08,113.67 E40.22 | 130.81,114.94 130.81,88.9 135.25,84.45 T22.B
MA4
  Bottom 0.381: D40TOP.15 136.53,121.28 137.16,120.65 137.16,118.75 139.7,116.2 E40.27 139.7,114.94 140.97,113.67 140.97,109.54 153.35,109.54 154.94,107.95 154.94,87.63 151.76,84.45 T23.B
MA5
  Top 0.381: T24.B 163.83,84.45 157.48,90.81 157.48,105.41 153.03,109.86 144.78,109.86 E40.32 144.78,113.67 143.51,114.94 143.51,116.2 141.6,118.11 141.6,121.28 D40BOT.18
MA6
  Bottom 0.381: T25.B 180.34,84.45 187.96,92.08 187.96,102.55 198.12,102.55 198.12,110.49 196.85,111.76 196.85,113.67 198.12,114.94 F40.3 198.12,116.2 201.29,119.38 201.29,121.28 E40TOP.2
MA7
  Top 0.381: E40BOT.4 204.47,121.28 204.47,114.94 203.2,113.67 F40.8 203.2,112.39 200.03,109.22 193.68,109.22 192.41,107.95 192.41,104.78 195.58,101.6 195.58,85.09 194.94,84.45 T26.B
MA8
  Bottom 0.381: T27.B 208.91,84.45 212.09,87.63 212.09,113.67 210.82,114.94 F40.13 210.19,115.57 210.19,120.65 209.55,121.28 E40TOP.7
MA9
  Top 0.381: 219.71,111.12 220.98,112.39 F40.22 | 219.71,111.12 218.44,109.86 218.44,102.87 219.71,101.6 219.71,85.72 220.98,84.45 T28.B | 219.71,111.12 219.71,116.2 217.81,118.11 217.81,121.28 E40BOT.12
MA10
  Bottom 0.381: T29.B 237.49,84.45 240.66,87.63 240.66,108.9 240.03,109.54 229.87,109.54 229.87,113.67 228.6,114.94 F40.27 228.6,116.84 226.06,116.84 222.88,120.02 222.88,120.65 222.25,121.28 E40TOP.15
MA11
  Top 0.381: 234.95,111.76 233.68,111.76 F40.32 | 234.95,111.76 236.85,111.76 243.84,104.78 243.84,90.17 249.56,84.45 T30.B | 234.95,111.76 234.95,118.11 229.24,118.11 227.33,120.02 227.33,121.28 E40BOT.18
MB0
  Bottom 0.381: T31.B 94.61,62.23 100.97,68.58 100.97,96.52 109.22,104.78 109.22,111.12 110.49,112.39 110.49,113.67 111.76,114.94 E40.5 112.39,115.57 116.84,120.02 116.84,120.65 117.47,121.28 D40TOP.3
MB1
  Top 0.381: T32.B 106.68,62.23 105.41,63.5 105.41,101.6 104.14,102.87 104.14,107.95 106.68,110.49 109.22,110.49 109.22,111.12 111.12,113.03 E40.6 111.76,113.67 113.03,114.94 113.03,116.2 116.84,120.02 116.84,120.65 117.47,121.28 D40BOT.3
MB2
  Bottom 0.381: 125.73,115.57 125.73,121.28 D40TOP.8 | 125.73,115.57 125.73,112.39 126.36,111.76 126.36,65.41 123.19,62.23 T33.B | 125.73,115.57 E40.15
MB3
  Top 0.381: 125.73,111.12 124.46,112.39 E40.16 | 125.73,111.12 128.91,107.95 128.91,68.58 135.25,62.23 T34.B | 125.73,111.12 125.73,116.2 129.54,120.02 129.54,120.65 130.18,121.28 D40BOT.11
MB4
  Top 0.381: T35.B 149.86,62.23 143.51,68.58 143.51,113.67 142.24,114.94 E40.29
  Bottom 0.381: D40TOP.16 138.43,121.28 138.43,120.02 142.24,116.2 E40.29
MB5
  Top 0.381: T36.B 163.83,61.59 152.4,50.16 152.4,48.26 151.76,47.62 142.24,47.62 E40.30 142.24,113.67 140.97,114.94 140.97,116.2 140.34,116.84 140.34,120.65 139.7,121.28 D40BOT.17
MB6
  Bottom 0.381: T37.B 180.34,62.23 187.96,69.85 187.96,85.72 199.39,97.16 199.39,113.67 200.66,114.94 F40.5 200.66,116.2 202.56,118.11 202.56,120.65 203.2,121.28 E40TOP.3
MB7
  Top 0.381: E40BOT.3 203.2,121.28 202.56,120.65 202.56,116.84 201.93,116.2 201.93,114.94 200.66,113.67 F40.6 200.03,113.03 200.03,110.49 190.82,110.49 188.28,107.95 188.28,104.46 191.13,101.6 191.13,63.5 192.41,62.23 T38.B
MB8
  Bottom 0.381: E40TOP.8 211.46,121.28 211.46,118.11 213.36,116.2 F40.15 213.36,114.94 214.63,113.67 214.63,112.39 214,111.76 214,67.31 208.91,62.23 T39.B
MB9
  Top 0.381: 214.63,111.12 214.63,68.58 220.98,62.23 T40.B | 214.63,111.12 213.36,112.39 F40.16 | 214.63,111.12 214.63,116.2 215.26,116.84 215.26,120.65 215.9,121.28 E40BOT.11
MB10
  Top 0.381: T41.B 235.59,62.23 229.87,67.94 229.87,113.67 231.14,114.94 F40.29
  Bottom 0.381: F40.29 231.14,117.79 226.38,117.79 224.16,120.02 224.16,121.28 E40TOP.16
MB11
  Top 0.381: E40BOT.17 225.43,121.28 226.06,120.65 226.06,120.02 229.24,116.84 232.41,116.84 232.41,114.94 231.14,113.67 F40.30 231.14,106.05 233.68,103.5 233.68,93.98 238.76,88.9 238.76,73.03 249.56,62.23 T42.B
MQ0
  Bottom 0.381: T55.B 94.61,17.78 106.05,17.78 106.05,88.27 115.57,97.79 115.57,113.67 116.84,114.94 E40.9 116.84,116.2 120.02,119.38 120.02,120.65 120.65,121.28 D40TOP.5
MQ1
  Top 0.381: 100.97,61.59 100.97,107.95 106.05,113.03 E40.2 | 100.97,61.59 100.97,23.5 106.68,17.78 T56.B | 100.97,61.59 91.44,71.12 91.44,93.98 89.53,95.89 89.53,121.28 114.3,121.28 D40BOT.1
MQ2
  Bottom 0.381: D40TOP.13 133.35,115.57 | 133.35,115.57 133.35,112.39 132.72,111.76 132.72,104.78 133.99,103.5 133.99,17.78 123.19,17.78 T57.B | 133.35,115.57 E40.23
MQ3
  Top 0.381: 120.65,111.76 119.38,111.76 E40.12 | 120.65,111.76 122.56,111.76 126.36,107.95 126.36,26.67 135.25,17.78 T58.B | 120.65,111.76 120.65,116.2 121.92,117.47 121.92,121.28 D40BOT.6
MQ4
  Bottom 0.381: T59.B 151.76,17.78 157.48,23.5 157.48,108.58 150.5,115.57 E40.33 147.32,116.84 144.78,116.84 141.6,120.02 141.6,121.28 D40TOP.18
MQ5
  Top 0.381: T60.B 163.83,17.78 153.03,17.78 153.03,22.86 138.43,37.47 138.43,104.14 137.79,104.78 137.79,113.03 E40.26 137.16,113.67 135.89,114.94 135.89,120.65 136.53,121.28 D40BOT.15
MQ6
  Bottom 0.381: T61.B 180.34,17.78 191.77,17.78 191.77,66.04 205.1,79.38 205.1,103.5 203.84,104.78 203.84,111.76 204.47,112.39 204.47,113.67 205.74,114.94 F40.9 205.74,120.65 206.38,121.28 E40TOP.5
MQ7
  Top 0.381: T62.B 192.41,17.78 191.13,19.05 191.13,40.01 184.15,46.99 184.15,106.68 190.5,113.03 F40.2 195.58,113.67 196.85,114.94 196.85,118.11 200.03,121.28 E40BOT.1
MQ8
  Bottom 0.381: T63.B 208.91,17.78 216.53,25.4 216.53,106.68 222.25,112.39 222.25,113.67 223.52,114.94 F40.23 223.52,116.2 219.71,120.02 219.71,120.65 219.07,121.28 E40TOP.13
MQ9
  Top 0.381: T64.B 220.98,17.78 215.26,23.5 215.26,39.37 205.1,49.53 205.1,103.5 203.84,104.78 203.84,107.95 208.28,112.39 F40.12 208.28,113.67 209.55,114.94 209.55,116.2 208.28,117.47 208.28,121.28 E40BOT.6
MQ10
  Bottom 0.381: T65.B 237.49,17.78 243.21,23.5 243.21,109.22 236.85,115.57 F40.33 236.22,120.02 227.33,120.02 227.33,121.28 E40TOP.18
MQ11
  Top 0.381: T66.B 249.56,17.78 238.76,17.78 238.76,20.95 235.59,24.13 227.33,24.13 227.33,66.67 226.06,67.94 F40.26 226.06,113.67 224.79,114.94 224.79,116.2 222.88,118.11 222.88,120.65 222.25,121.28 E40BOT.15
N$1
  Top 0.381: T1.C 5.71,105.41 7.62,103.5 7.62,100.33 DF0.B
N$2
  Top 0.381: T2.C 19.68,105.41 19.68,102.87 22.23,100.33 DF1.B
N$3
  Top 0.381: T3.C 34.29,105.41 36.2,103.5 36.2,100.33 DF2.B
N$4
  Top 0.381: IF0.B 50.8,103.5 48.9,105.41 T4.C
N$5
  Top 0.381: T5.C 62.87,105.41 64.77,103.5 64.77,100.33 IF1.B
N$6
  Top 0.381: IF2.B 79.38,103.5 77.47,105.41 T6.C
N$7
  Top 0.381: T7.C 91.44,105.41 93.34,103.5 93.34,100.33 PC0.B
N$8
  Top 0.381: T8.C 105.41,102.87 107.95,100.33 PC1.B
N$9
  Top 0.381: T9.C 120.02,105.41 121.92,103.5 121.92,100.33 PC2.B
N$10
  Top 0.381: PC3.B 136.53,103.5 134.62,105.41 T10.C
N$11
  Top 0.381: T11.C 148.59,105.41 150.5,103.5 150.5,100.33 PC4.B
N$12
  Top 0.381: T12.C 161.93,105.41 161.93,97.16 163.83,95.25 167,95.25 167,97.79 165.74,99.06 PC5.B
N$13
  Top 0.381: T13.C 177.16,105.41 179.07,103.5 179.07,100.33 PC6.B
N$14
  Top 0.381: T14.C 191.13,102.87 193.68,100.33 PC7.B
N$15
  Top 0.381: T15.C 205.74,105.41 207.65,103.5 207.65,100.33 PC8.B
N$16
  Top 0.381: T16.C 219.71,102.87 222.25,100.33 PC9.B
N$17
  Top 0.381: T17.C 234.31,105.41 236.22,103.5 236.22,100.33 PC10.B
N$18
  Top 0.381: PC11.B 250.82,103.5 248.92,105.41 T18.C
N$19
  Top 0.381: T19.C 93.34,81.28 93.34,78.11 MA0.B
N$20
  Top 0.381: MA1.B T20.C
N$21
  Top 0.381: T21.C 121.92,81.28 121.92,78.11 MA2.B
N$22
  Top 0.381: MA3.B T22.C
N$23
  Top 0.381: T23.C 150.5,81.28 150.5,78.11 MA4.B
N$24
  Top 0.381: MA5.B T24.C
N$25
  Top 0.381: T25.C 179.07,81.28 179.07,78.11 MA6.B
N$26
  Top 0.381: MA7.B T26.C
N$27
  Top 0.381: T27.C 207.65,81.28 207.65,78.11 MA8.B
N$28
  Top 0.381: MA9.B T28.C
N$29
  Top 0.381: T29.C 236.22,81.28 236.22,78.11 MA10.B
N$30
  Top 0.381: MA11.B T30.C
N$31
  Top 0.381: T31.C 93.34,59.05 93.34,55.88 MB0.B
N$32
  Top 0.381: MB1.B T32.C
N$33
  Top 0.381: T33.C 121.92,59.05 121.92,55.88 MB2.B
N$34
  Top 0.381: MB3.B T34.C
N$35
  Top 0.381: T35.C 150.5,59.05 150.5,55.88 MB4.B
N$36
  Top 0.381: MB5.B T36.C
N$37
  Top 0.381: T37.C 179.07,59.05 179.07,55.88 MB6.B
N$38
  Top 0.381: MB7.B T38.C
N$39
  Top 0.381: T39.C 207.65,59.05 207.65,55.88 MB8.B
N$40
  Top 0.381: MB9.B T40.C
N$41
  Top 0.381: T41.C 236.22,59.05 236.22,55.88 MB10.B
N$42
  Top 0.381: MB11.B T42.C
N$43
  Top 0.381: T43.C 93.34,36.83 93.34,33.66 AC0.B
N$44
  Top 0.381: AC1.B T44.C
N$45
  Top 0.381: T45.C 121.92,36.83 121.92,33.66 AC2.B
N$46
  Top 0.381: AC3.B T46.C
N$47
  Top 0.381: T47.C 150.5,36.83 150.5,33.66 AC4.B
N$48
  Top 0.381: AC5.B T48.C
N$49
  Top 0.381: T49.C 179.07,36.83 179.07,33.66 AC6.B
N$50
  Top 0.381: AC7.B T50.C
N$51
  Top 0.381: T51.C 207.65,36.83 207.65,33.66 AC8.B
N$52
  Top 0.381: AC9.B T52.C
N$53
  Top 0.381: T53.C 236.22,36.83 236.22,33.66 AC10.B
N$54
  Top 0.381: AC11.B T54.C
N$55
  Top 0.381: T55.C 93.34,14.61 93.34,11.43 MQ0.B
N$56
  Top 0.381: MQ1.B T56.C
N$57
  Top 0.381: T57.C 121.92,14.61 121.92,11.43 MQ2.B
N$58
  Top 0.381: MQ3.B T58.C
N$59
  Top 0.381: T59.C 150.5,14.61 150.5,11.43 MQ4.B
N$60
  Top 0.381: MQ5.B T60.C
N$61
  Top 0.381: T61.C 179.07,14.61 179.07,11.43 MQ6.B
N$62
  Top 0.381: MQ7.B T62.C
N$63
  Top 0.381: T63.C 207.65,14.61 207.65,11.43 MQ8.B
N$64
  Top 0.381: MQ9.B T64.C
N$65
  Top 0.381: T65.C 236.22,14.61 236.22,11.43 MQ10.B
N$66
  Top 0.381: MQ11.B T66.C
N$67
  Top 0.381: SC0.B T67.C
N$68
  Top 0.381: T68.C 20.32,14.61 20.32,11.43 SC1.B
N$69
  Top 0.381: SC2.B T69.C
N$70
  Top 0.381: T70.C 48.9,14.61 48.9,11.43 SC3.B
N$71
  Top 0.381: SC4.B T71.C
N$72
  Top 0.381: LINK.B T72.C
N$73
  Top 0.381: T73.C 358.14,96.52 363.22,96.52 363.22,97.79 364.49,99.06 ION.B
N$74
  Top 0.381: PAUSE.B 363.22,86.36 363.22,85.09 358.14,85.09 T74.C
N$75
  Top 0.381: T75.C 358.14,74.3 363.22,74.3 363.22,75.56 364.49,76.83 RUN.B
N$76
  Top 0.381: T76.C 343.54,96.52 338.45,96.52 338.45,97.79 337.19,99.06 FETCH.B
N$77
  Top 0.381: EXECUTE.B 338.45,86.36 338.45,85.09 343.54,85.09 T77.C
N$78
  Top 0.381: T78.C 338.45,73.66 338.45,75.56 337.19,76.83 DEFER.B
N$79
  Top 0.381: WORDCOUNT.B 338.45,64.14 338.45,62.87 343.54,62.87 T79.C
N$80
  Top 0.381: T80.C 343.54,52.07 338.45,52.07 338.45,53.34 337.19,54.61 CURRENTADDRESS.B
N$81
  Top 0.381: BREAK.B 338.45,41.91 338.45,40.64 343.54,40.64 T81.C
N$82
  Top 0.381: T82.C 314.96,96.52 309.88,96.52 309.88,97.79 308.61,99.06 AND.B
N$83
  Top 0.381: TAD.B 309.88,86.36 309.88,85.09 314.96,85.09 T83.C
N$84
  Top 0.381: T84.C 314.96,74.3 309.88,74.3 309.88,75.56 308.61,76.83 ISZ.B
N$85
  Top 0.381: DCA.B 309.88,64.14 309.88,62.87 314.96,62.87 T85.C
N$86
  Top 0.381: T86.C 314.96,52.07 309.88,52.07 309.88,53.34 308.61,54.61 JMS.B
N$87
  Top 0.381: JMP.B 309.88,41.91 309.88,40.64 314.96,40.64 T87.C
N$88
  Top 0.381: T88.C 314.96,29.84 309.88,29.84 309.88,31.11 308.61,32.38 IOT.B
N$89
  Top 0.381: OPR.B 309.88,19.68 309.88,18.41 314.96,18.41 T89.C
N$90
  Top 0.381: R1.2 7.62,93.98 7.62,95.89 DF0.A
N$91
  Top 0.381: R2.2 22.23,93.98 22.23,95.89 DF1.A
N$92
  Top 0.381: R3.2 36.2,93.98 36.2,95.89 DF2.A
N$93
  Top 0.381: R4.2 50.8,93.98 50.8,95.89 IF0.A
N$94
  Top 0.381: R5.2 64.77,93.98 64.77,95.89 IF1.A
N$95
  Top 0.381: R6.2 79.38,93.98 79.38,95.89 IF2.A
N$96
  Top 0.381: R7.2 93.34,93.98 93.34,95.89 PC0.A
N$97
  Top 0.381: R8.2 107.95,93.98 107.95,95.89 PC1.A
N$98
  Top 0.381: R9.2 121.92,93.98 121.92,95.89 PC2.A
N$99
  Top 0.381: R10.2 136.53,93.98 136.53,95.89 PC3.A
N$100
  Top 0.381: R11.2 150.5,93.98 150.5,95.89 PC4.A
N$101
  Top 0.381: R12.2 169.54,97.16 167,99.69 167,100.33 166.37,100.97 163.19,100.97 163.19,98.42 164.47,97.16 PC5.A
N$102
  Top 0.381: R13.2 179.07,93.98 179.07,95.89 PC6.A
N$103
  Top 0.381: R14.2 193.68,93.98 193.68,95.89 PC7.A
N$104
  Top 0.381: R15.2 207.65,93.98 207.65,95.89 PC8.A
N$105
  Top 0.381: R16.2 222.25,93.98 222.25,95.89 PC9.A
N$106
  Top 0.381: R17.2 236.22,93.98 236.22,95.89 PC10.A
N$107
  Top 0.381: R18.2 250.82,93.98 250.82,95.89 PC11.A
N$108
  Top 0.381: R73.2 365.12,93.98 365.12,95.89 ION.A
N$109
  Top 0.381: R74.2 365.12,83.19 365.12,85.09 PAUSE.A
N$110
  Top 0.381: R75.2 365.12,71.75 365.12,73.66 RUN.A
N$111
  Top 0.381: R19.2 93.34,71.75 93.34,73.66 MA0.A
N$112
  Top 0.381: R20.2 107.95,71.75 107.95,73.66 MA1.A
N$113
  Top 0.381: R21.2 121.92,71.75 121.92,73.66 MA2.A
N$114
  Top 0.381: R22.2 136.53,71.75 136.53,73.66 MA3.A
N$115
  Top 0.381: R23.2 150.5,71.75 150.5,73.66 MA4.A
N$116
  Top 0.381: R24.2 169.54,74.3 165.74,74.3 MA5.A
N$117
  Top 0.381: R25.2 179.07,71.75 179.07,73.66 MA6.A
N$118
  Top 0.381: R26.2 193.68,71.75 193.68,73.66 MA7.A
N$119
  Top 0.381: R27.2 207.65,71.75 207.65,73.66 MA8.A
N$120
  Top 0.381: R28.2 222.25,71.75 222.25,73.66 MA9.A
N$121
  Top 0.381: R29.2 236.22,71.75 236.22,73.66 MA10.A
N$122
  Top 0.381: R30.2 250.82,71.75 250.82,73.66 MA11.A
N$123
  Top 0.381: R76.2 336.55,93.98 336.55,95.89 FETCH.A
N$124
  Top 0.381: R77.2 336.55,83.19 336.55,85.09 EXECUTE.A
N$125
  Top 0.381: R78.2 336.55,71.75 336.55,73.66 DEFER.A
N$126
  Top 0.381: R79.2 336.55,60.96 336.55,62.87 WORDCOUNT.A
N$127
  Top 0.381: R80.2 336.55,49.53 336.55,51.44 CURRENTADDRESS.A
N$128
  Top 0.381: R81.2 336.55,38.73 336.55,40.64 BREAK.A
N$129
  Top 0.381: R72.2 79.38,27.3 79.38,29.21 LINK.A
N$130
  Top 0.381: R31.2 93.34,49.53 93.34,51.44 MB0.A
N$131
  Top 0.381: R32.2 107.95,49.53 107.95,51.44 MB1.A
N$132
  Top 0.381: R33.2 121.92,49.53 121.92,51.44 MB2.A
N$133
  Top 0.381: R34.2 136.53,49.53 136.53,51.44 MB3.A
N$134
  Top 0.381: R35.2 150.5,49.53 150.5,51.44 MB4.A
N$135
  Top 0.381: R36.2 169.54,52.07 165.74,52.07 MB5.A
N$136
  Top 0.381: R37.2 179.07,49.53 179.07,51.44 MB6.A
N$137
  Top 0.381: R38.2 193.68,49.53 193.68,51.44 MB7.A
N$138
  Top 0.381: R39.2 207.65,49.53 207.65,51.44 MB8.A
N$139
  Top 0.381: R40.2 222.25,49.53 222.25,51.44 MB9.A
N$140
  Top 0.381: R41.2 236.22,49.53 236.22,51.44 MB10.A
N$141
  Top 0.381: R42.2 250.82,49.53 250.82,51.44 MB11.A
N$142
  Top 0.381: R43.2 93.34,27.3 93.34,29.21 AC0.A
N$143
  Top 0.381: R44.2 107.95,27.3 107.95,29.21 AC1.A
N$144
  Top 0.381: R45.2 121.92,27.3 121.92,29.21 AC2.A
N$145
  Top 0.381: R46.2 136.53,27.3 136.53,29.21 AC3.A
N$146
  Top 0.381: R47.2 150.5,27.3 150.5,29.21 AC4.A
N$147
  Top 0.381: R48.2 169.54,29.84 165.74,29.84 AC5.A
N$148
  Top 0.381: R49.2 179.07,27.3 179.07,29.21 AC6.A
N$149
  Top 0.381: R50.2 193.68,27.3 193.68,29.21 AC7.A
N$150
  Top 0.381: R51.2 207.65,27.3 207.65,29.21 AC8.A
N$151
  Top 0.381: R52.2 222.25,27.3 222.25,29.21 AC9.A
N$152
  Top 0.381: R53.2 236.22,27.3 236.22,29.21 AC10.A
N$153
  Top 0.381: R54.2 250.82,27.3 250.82,29.21 AC11.A
N$154
  Top 0.381: R67.2 6.35,5.08 6.35,6.99 SC0.A
N$155
  Top 0.381: R68.2 20.32,5.08 20.32,6.99 SC1.A
N$156
  Top 0.381: R69.2 34.92,5.08 34.92,6.99 SC2.A
N$157
  Top 0.381: R70.2 48.9,5.08 48.9,6.99 SC3.A
N$158
  Top 0.381: R71.2 63.5,5.08 63.5,6.99 SC4.A
N$159
  Top 0.381: R66.2 250.82,5.08 250.82,6.99 MQ11.A
N$160
  Top 0.381: R65.2 236.22,5.08 236.22,6.99 MQ10.A
N$161
  Top 0.381: R64.2 222.25,5.08 222.25,6.99 MQ9.A
N$162
  Top 0.381: R63.2 207.65,5.08 207.65,6.99 MQ8.A
N$163
  Top 0.381: R62.2 193.68,5.08 193.68,6.99 MQ7.A
N$164
  Top 0.381: R61.2 179.07,5.08 179.07,6.99 MQ6.A
N$165
  Top 0.381: R60.2 170.81,3.17 165.74,8.26 MQ5.A
N$166
  Top 0.381: R59.2 150.5,5.08 150.5,6.99 MQ4.A
N$167
  Top 0.381: R58.2 136.53,5.08 136.53,6.99 MQ3.A
N$168
  Top 0.381: R57.2 121.92,5.08 121.92,6.99 MQ2.A
N$169
  Top 0.381: R56.2 107.95,5.08 107.95,6.99 MQ1.A
N$170
  Top 0.381: R55.2 93.34,5.08 93.34,6.99 MQ0.A
N$171
  Top 0.381: R82.2 307.98,93.98 307.98,95.89 AND.A
N$172
  Top 0.381: R83.2 307.98,83.19 307.98,85.09 TAD.A
N$173
  Top 0.381: R84.2 307.98,71.75 307.98,73.66 ISZ.A
N$174
  Top 0.381: R85.2 307.98,60.33 307.98,62.87 DCA.A
N$175
  Top 0.381: R86.2 307.98,49.53 307.98,51.44 JMS.A
N$176
  Top 0.381: R87.2 307.98,38.73 307.98,40.64 JMP.A
N$177
  Top 0.381: R88.2 307.98,27.3 307.98,29.21 IOT.A
N$178
  Top 0.381: R89.2 307.98,16.51 307.98,18.41 OPR.A
OPR
  Top 0.381: T89.B 316.87,20.95 327.66,31.75 D40.16 327.66,113.67 328.93,114.94 328.93,116.2 329.56,116.84 329.56,120.65 330.2,121.28 F40BOT.11
PAUSE
  Top 0.381: T74.B 356.24,87.63 351.79,92.08 351.79,102.23 349.25,104.78 349.25,113.67 347.98,114.94 D40.31
  Bottom 0.381: F40TOP.17 339.73,121.28 340.36,120.65 340.36,120.02 343.54,116.84 347.98,116.84 D40.31
PC0
  Top 0.381: E40.1 102.23,115.57 93.98,107.31 T7.B
  Bottom 0.381: E40.1 106.68,121.28 114.3,121.28 D40TOP.1
PC1
  Top 0.381: T8.B 108.58,107.31 111.76,110.49 116.2,110.49 116.2,113.03 E40.10 116.84,113.67 118.11,114.94 118.11,116.2 120.02,118.11 120.02,120.65 120.65,121.28 D40BOT.5
PC2
  Top 0.381: T9.B 121.92,107.31 118.11,111.12 118.11,113.67 119.38,114.94 E40.11
  Bottom 0.381: D40TOP.6 121.92,121.28 121.92,118.75 119.38,116.2 E40.11
PC3
  Top 0.381: D40BOT.14 134.62,121.28 134.62,117.47 133.35,116.2 133.35,114.94 134.62,113.67 E40.24 134.62,108.58 135.89,107.31 T10.B
PC4
  Bottom 0.381: T11.B 150.5,107.31 149.22,108.58 138.43,108.58 138.43,113.67 137.16,114.94 E40.25 137.16,116.2 135.25,118.11 135.25,121.28 D40TOP.14
PC5
  Top 0.381: 148.59,111.12 147.32,111.12 E40.34 | 148.59,111.12 160.66,111.12 164.47,107.31 T12.B | 148.59,111.12 148.59,121.28 142.88,121.28 D40BOT.19
PC6
  Top 0.381: F40.1 187.96,115.57 179.71,107.31 T13.B
  Bottom 0.381: E40TOP.1 200.03,121.28 195.58,116.84 F40.1
PC7
  Top 0.381: E40BOT.5 206.38,121.28 207.01,120.65 207.01,114.94 205.74,113.67 F40.10 205.74,112.39 202.25,108.9 202.25,104.14 195.58,104.14 194.31,105.41 T14.B
PC8
  Bottom 0.381: T15.B 208.28,107.31 209.55,108.58 209.55,113.67 208.28,114.94 F40.11 208.28,121.28 E40TOP.6
PC9
  Top 0.381: T16.B 222.88,107.31 223.52,107.95 F40.24 223.52,113.67 222.25,114.94 222.25,116.2 220.98,117.47 220.98,121.28 E40BOT.14
PC10
  Bottom 0.381: T17.B 236.22,107.31 234.95,108.58 227.33,108.58 227.33,113.67 226.06,114.94 F40.25 225.43,115.57 220.98,120.02 220.98,121.28 E40TOP.14
PC11
  Top 0.381: 237.49,113.03 244.47,113.03 250.19,107.31 T18.B | F40.34 237.49,113.03 | 237.49,113.03 237.49,121.28 228.6,121.28 E40BOT.19
RUN
  Top 0.381: T75.B 358.14,76.83 363.22,76.83 363.22,78.74 367.03,82.55 367.03,100.33 351.79,115.57 D40.33
  Bottom 0.381: D40.33 350.52,118.11 343.54,118.11 341.63,120.02 341.63,121.28 F40TOP.18
SC0
  Top 0.381: T67.B 7.62,17.14 19.05,5.71 19.05,3.81 19.68,3.17 29.21,3.17 29.21,106.05 35.56,112.39 35.56,113.67 34.29,114.94 C40.9
  Bottom 0.381: C40.9 34.29,120.65 34.92,121.28 C40TOP.5
SC1
  Top 0.381: T68.B 21.59,17.78 24.13,20.32 24.13,101.6 20.95,104.78 20.95,109.22 24.13,112.39 C40.2 24.13,113.67 25.4,114.94 25.4,118.11 28.57,121.28 C40BOT.1
SC2
  Top 0.381: T69.B 36.2,17.14 47.62,5.71 47.62,3.81 48.26,3.17 54.61,3.17 54.61,111.12 53.34,112.39 53.34,113.67 52.07,114.94 C40.23
  Bottom 0.381: C40TOP.13 47.62,121.28 48.26,120.65 48.26,120.02 52.07,116.2 C40.23
SC3
  Top 0.381: 38.1,118.75 36.83,120.02 36.83,121.28 C40BOT.6 | 38.1,118.75 40.64,116.2 40.64,25.4 48.26,17.78 T70.B | 38.1,118.75 35.56,116.2 35.56,114.94 36.83,113.67 C40.12
SC4
  Top 0.381: C40.33 73.03,115.57 80.64,107.95 80.64,104.78 82.55,102.87 82.55,17.78 64.77,17.78 T71.B
  Bottom 0.381: C40TOP.18 55.88,121.28 55.88,120.02 59.05,116.84 64.77,116.84 C40.33
TAD
  Top 0.381: 313.69,109.54 312.42,110.81 D40.4 | 313.69,109.54 318.13,105.09 318.13,88.9 316.87,87.63 T83.B | F40BOT.2 315.6,121.28 315.6,118.11 313.69,116.2 313.69,109.54
WC
  Top 0.381: T79.B 345.44,65.41 349.25,69.22 349.25,102.23 345.44,106.05 D40.30 345.44,113.67 344.17,114.94 344.17,116.2 340.36,120.02 340.36,120.65 339.73,121.28 F40BOT.17

## Text on the board
Bottom: PDP-8/I Light Board 50045108 | A | 5404519 | VRS